# EAGLE schematic peldaszamlalo (EAGLE 6.4)
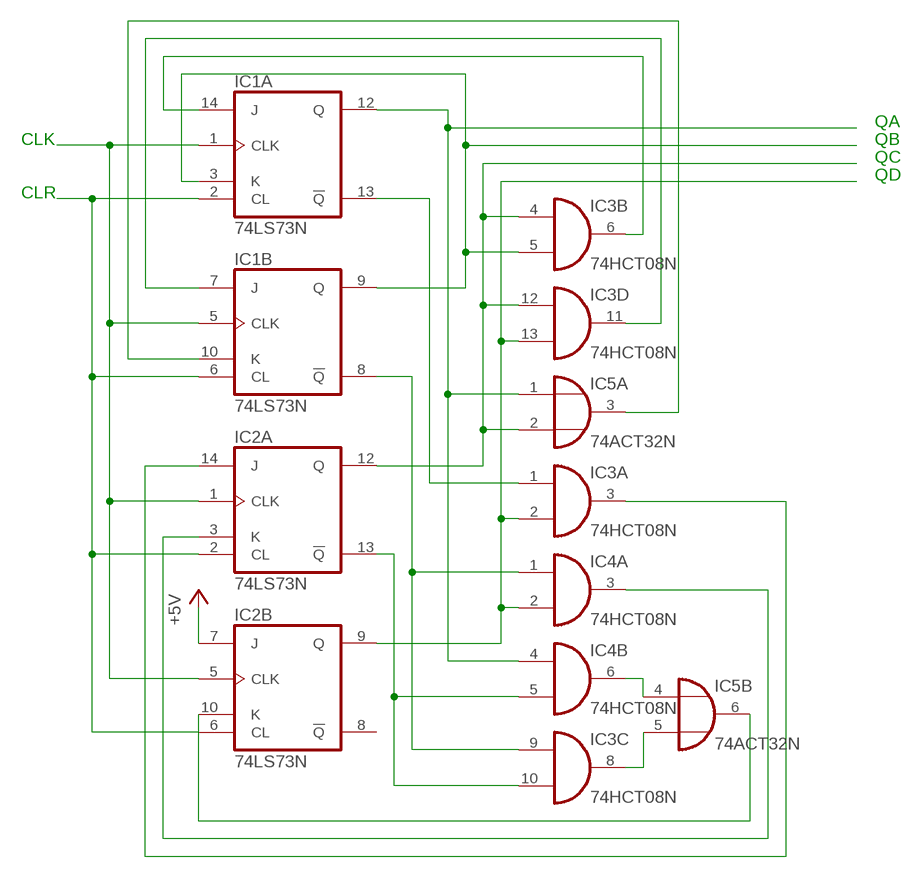
[diagram p0: schematic, sheet 1]

## Parts
IC1  74LS73N  [DIL14]
IC2  74LS73N  [DIL14]
IC3  74HCT08N  [DIL14]
IC4  74HCT08N  [DIL14]
IC5  74ACT32N  [DIL14]

## Nets
+5V: IC2.7(B:J)
N$1: IC1.2(A:CL) IC1.6(B:CL) IC2.2(A:CL) IC2.6(B:CL)
N$2: IC1.1(A:CLK) IC1.5(B:CLK) IC2.1(A:CLK) IC2.5(B:CLK)
N$3: IC1.12(A:Q) IC4.4(B:I0) IC5.1(A:I0)
N$4: IC1.3(A:K) IC1.9(B:Q) IC3.5(B:I1)
N$5: IC2.12(A:Q) IC3.4(B:I0) IC3.12(D:I0) IC5.2(A:I1)
N$6: IC2.9(B:Q) IC3.2(A:I1) IC3.13(D:I1) IC4.2(A:I1)
N$7: IC1.13(A:!Q) IC3.1(A:I0)
N$8: IC1.14(A:J) IC3.6(B:O)
N$9: IC1.8(B:!Q) IC3.9(C:I0) IC4.1(A:I0)
N$10: IC2.13(A:!Q) IC3.10(C:I1) IC4.5(B:I1)
N$11: IC4.6(B:O) IC5.4(B:I0)
N$12: IC3.8(C:O) IC5.5(B:I1)
N$13: IC2.10(B:K) IC5.6(B:O)
N$14: IC2.3(A:K) IC4.3(A:O)
N$15: IC2.14(A:J) IC3.3(A:O)
N$16: IC1.7(B:J) IC3.11(D:O)
N$17: IC1.10(B:K) IC5.3(A:O)
Unconnected: IC2.8(B:!Q) IC4.8(C:O) IC4.9(C:I0) IC4.10(C:I1) IC4.11(D:O) IC4.12(D:I0) IC4.13(D:I1) IC5.8(C:O) IC5.9(C:I0) IC5.10(C:I1) IC5.11(D:O) IC5.12(D:I0) IC5.13(D:I1)

## Notes on the sheet
- QA
- CLK | QB
- QC
- QD
- CLR

## Power pins joined to a net without a drawn wire
GND: IC1.11(P:GND) IC2.11(P:GND) IC3.7(P:GND) IC4.7(P:GND) IC5.7(P:GND)
VCC: IC1.4(P:VCC) IC2.4(P:VCC) IC3.14(P:VCC) IC4.14(P:VCC) IC5.14(P:VCC)

## Library data of the parts
IC1 IC2 = 74xx-eu:74*73: Dual J-K FLIP FLOP, clear
IC3 IC4 = 74xx-eu:74*08: Quad 2-input AND gate
IC5 = 74xx-eu:74*32: Quad 2-input OR gate